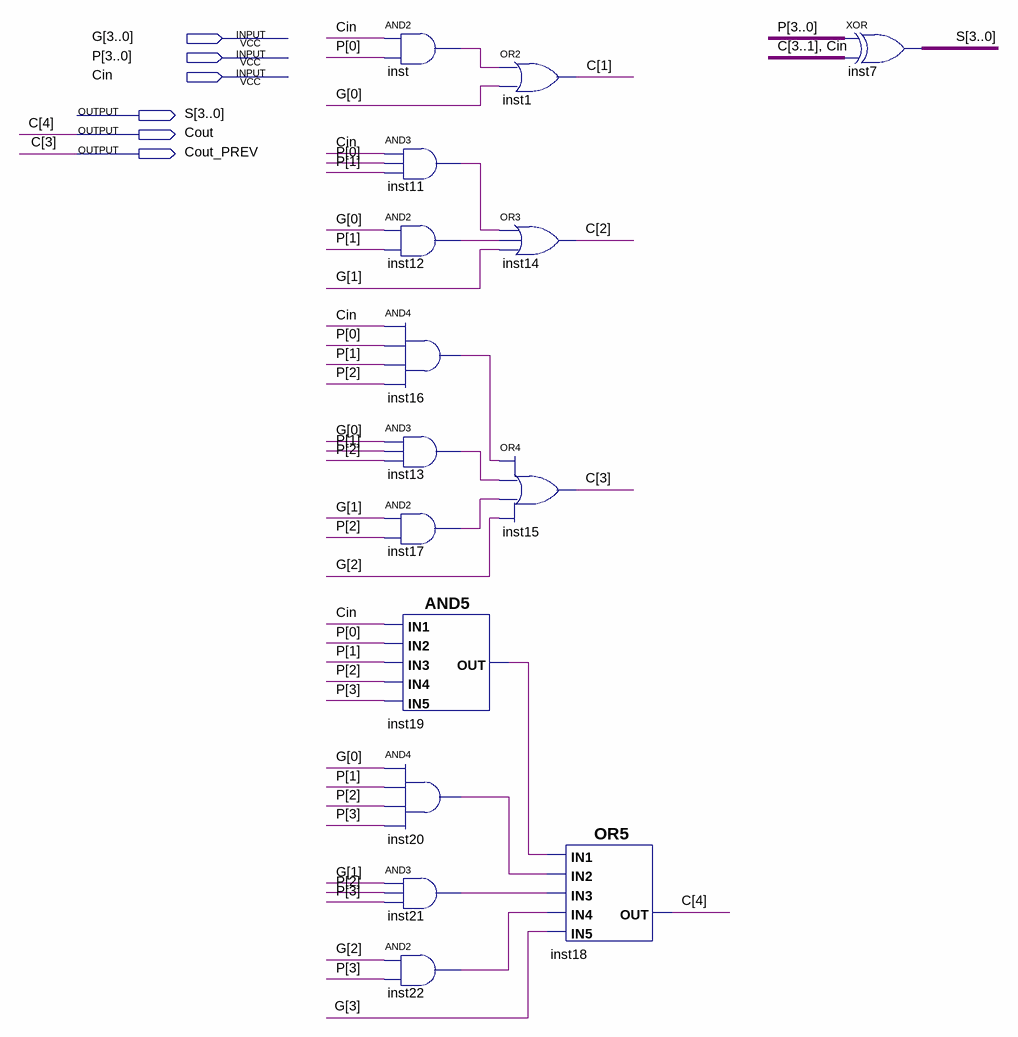
[diagram p0: schematic sheet]
// Quartus schematic CLA_Logic_4bit.bdf as structural Verilog: 15 symbols, 6 pins
module CLA_Logic_4bit (
  input  [3:0] G,
  input  [3:0] P,
  input  Cin,
  output [3:0] S,
  output Cout,
  output Cout_PREV
);

  wire inst11_out, inst12_out, inst13_out, inst16_out, inst17_out, inst19_out, inst20_out, inst21_out,
       inst22_out, inst_out;
  wire [2:1] C;

  and inst (inst_out, Cin, P[0]);
  and inst11 (inst11_out, Cin, P[0], P[1]);
  and inst12 (inst12_out, G[0], P[1]);
  and inst16 (inst16_out, Cin, P[0], P[1], P[2]);
  and inst13 (inst13_out, G[0], P[1], P[2]);
  and inst17 (inst17_out, G[1], P[2]);
  and inst19 (inst19_out, Cin, P[0], P[1], P[2], P[3]);
  and inst20 (inst20_out, G[0], P[1], P[2], P[3]);
  and inst21 (inst21_out, G[1], P[2], P[3]);
  and inst22 (inst22_out, G[2], P[3]);
  or inst1 (C[1], inst_out, G[0]);
  or inst14 (C[2], inst11_out, inst12_out, G[1]);
  or inst15 (Cout_PREV, inst16_out, inst13_out, inst17_out, G[2]);
  or inst18 (Cout, inst19_out, inst20_out, inst21_out, inst22_out, G[3]);
  assign S = P ^ {Cout_PREV, C, Cin};  // XOR inst7, 4 bits wide

  // Other names for the same wires on the sheet: C[4:3] = {Cout, Cout_PREV}
endmodule
